# EAGLE design shield (EAGLE 5.11)
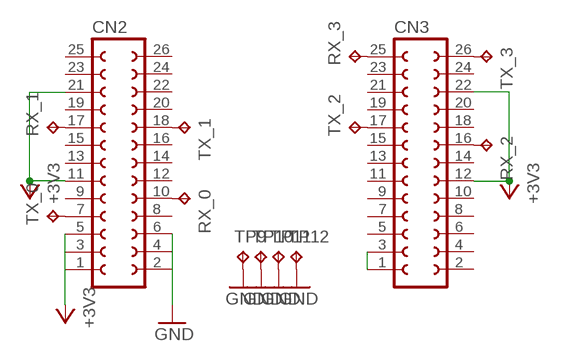
[diagram p0: schematic, sheet 1]

## Parts
CN2  FE13-2  [FE13-2]
CN3  FE13-2  [FE13-2]
RX_0  TPB1,27  [B1,27]
RX_1  TPB1,27  [B1,27]
RX_2  TPB1,27  [B1,27]
RX_3  TPB1,27  [B1,27]
TP9  TPB1,27  [B1,27]
TP10  TPB1,27  [B1,27]
TP11  TPB1,27  [B1,27]
TP12  TPB1,27  [B1,27]
TX_0  TPB1,27  [B1,27]
TX_1  TPB1,27  [B1,27]
TX_2  TPB1,27  [B1,27]
TX_3  TPB1,27  [B1,27]

## Nets
+3V3: CN2.1 CN2.3 CN2.5 CN2.11 CN2.21 CN3.12 CN3.22
GND: CN2.2 CN2.4 CN2.6 TP9.TP TP10.TP TP11.TP TP12.TP
N$1: CN3.1 CN3.3
N$4: CN2.7 TX_0.TP
N$5: CN2.10 RX_0.TP
N$6: CN2.18 TX_1.TP
N$7: CN2.17 RX_1.TP
N$8: CN3.17 TX_2.TP
N$9: CN3.16 RX_2.TP
N$10: CN3.25 RX_3.TP
N$11: CN3.26 TX_3.TP
Unconnected: CN2.8 CN2.9 CN2.12 CN2.13 CN2.14 CN2.15 CN2.16 CN2.19 CN2.20 CN2.22 CN2.23 CN2.24 CN2.25 CN2.26 CN3.2 CN3.4 CN3.5 CN3.6 CN3.7 CN3.8 CN3.9 CN3.10 CN3.11 CN3.13 CN3.14 CN3.15 CN3.18 CN3.19 CN3.20 CN3.21 CN3.23 CN3.24

## Library data of the parts
CN2 CN3 = con-lsta:FE13-2: FEMALE HEADER; OC_FARNELL: unknown; OC_NEWARK: unknown
RX_0 RX_1-RX_3 TP9-TP12 TX_0 TX_1-TX_3 = testpad:TP: Test pad

## Board
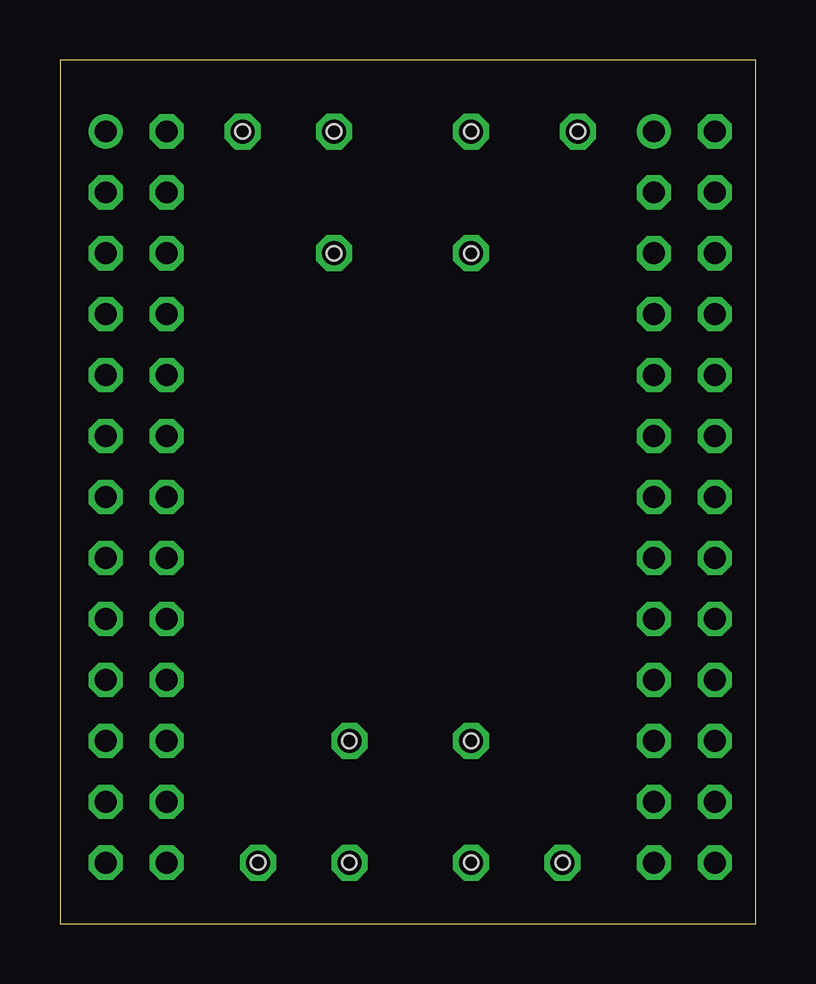
[diagram p1: board, top side]
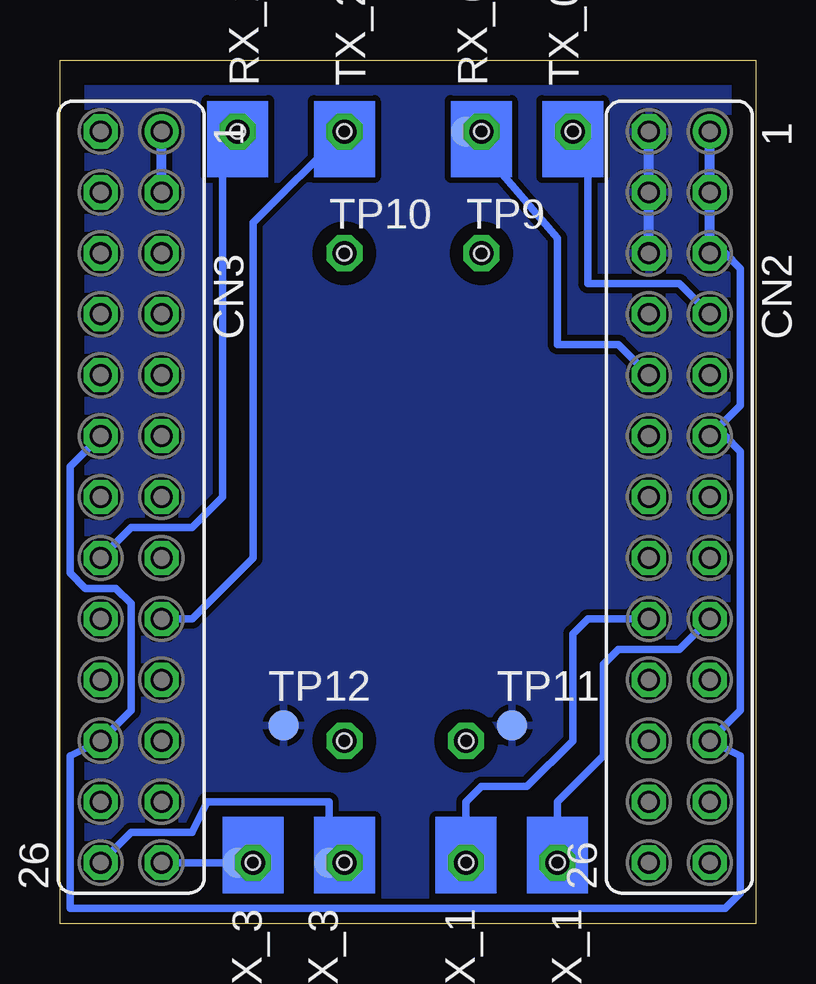
[diagram p2: board, bottom side, seen from below]

Size 29 x 36 mm. Coordinates in mm from the lower left corner, seen from the top.
Outline: 0,0 29,0 29,36 0,36 0,0
Copper layers (1*16): Top 0.035mm / dielectric 1.5mm / Bottom 0.035mm
Design rules "default *": minimum track width 10mil, minimum drill 24mil, track to track 10mil, track to pad 10mil, pad to pad 8mil, via to via 8mil, smd to smd 8mil, copper to edge 40mil, drill to drill 8mil, minimum pad ring 10mil, minimum via ring 8mil, stop-mask expansion 4mil, vias tented up to drill 0mil, thermal gap 10mil
Holes 0.6 mm at 17.14,33.02 21.59,33.02 11.43,33.02 7.62,33.02 11.43,27.94 17.14,27.94 8.26,2.54 12.06,2.54 12.06,7.62 17.14,7.62 17.14,2.54 20.95,2.54

### Footprints (pad centres in the part's own frame; a part is rotated, then mirrored left to right if it is on the bottom)
FE13-2 = drill 0.914 round: 1 -15.24,1.27 | drill 0.914 octagon: 2 -15.24,-1.27; 3 -12.7,1.27; 4 -12.7,-1.27; 5 -10.16,1.27; 6 -10.16,-1.27; 7 -7.62,1.27; 8 -7.62,-1.27; 9 -5.08,1.27; 10 -5.08,-1.27; 11 -2.54,1.27; 12 -2.54,-1.27; 13 0,1.27; 14 0,-1.27; 15 2.54,1.27; 16 2.54,-1.27; 17 5.08,1.27; 18 5.08,-1.27; 19 7.62,1.27; 20 7.62,-1.27; 21 10.16,1.27; 22 10.16,-1.27; 23 12.7,1.27; 24 12.7,-1.27; 25 15.24,1.27; 26 15.24,-1.27
B1,27 = smd 1.27 x 1.27: TP 0,0

### Placement (x,y rotation side)
CN2  3.17,17.78 270 bottom
CN3  26.04,17.78 270 bottom
RX_0  12.06,33.02 0 bottom
RX_1  8.26,2.54 0 bottom
RX_2  21.59,33.02 0 bottom
RX_3  21.59,2.54 0 bottom
TP9  11.43,27.94 0 bottom
TP10  17.14,27.94 0 bottom
TP11  10.16,8.26 0 bottom
TP12  19.68,8.26 0 bottom
TX_0  7.62,33.02 90 bottom
TX_1  12.06,2.54 0 bottom
TX_2  17.14,33.02 0 bottom
TX_3  17.78,2.54 0 bottom

### Tracks (layer width: path | path; a pad name or v marks a point on that pad's centre or on a via)
+3V3
  Bottom 0.305: CN3.12 28.57,19.05 28.57,14.61 27.94,13.97 26.67,13.97 26.04,13.34 26.04,8.89 CN3.22 28.57,6.99 28.57,0.64 1.27,0.64 0.64,1.27 0.64,6.99 CN2.21 0.64,8.89 0.64,19.68 1.27,20.32 CN2.11 0.64,21.59 0.64,27.3 1.27,27.94 CN2.5
  Bottom 0.406: CN2.1 CN2.3 CN2.5
GND  (via drill 1)
  Bottom 0.406: CN2.2 CN2.4 CN2.6
  other vias: 11.43,27.94 17.14,27.94
  pour Bottom: -1.27,37.47 30.48,37.47 30.48,-1.91 -1.27,-1.91
N$1
  Bottom 0.406: CN3.3 CN3.1
N$2  (via drill 1)
  other vias: 11.43,33.02
N$3  (via drill 1)
  other vias: 17.14,2.54
N$4  (via drill 1)
  Bottom 0.305: CN2.7 3.17,26.67 6.99,26.67 6.99,32.38 TX_0.TP
  other vias: 7.62,33.02
N$5
  Bottom 0.305: CN2.10 5.71,24.13 8.26,24.13 8.26,28.57 RX_0.TP
N$6  (via drill 1)
  Bottom 0.305: CN2.18 6.99,12.7 7.62,12.06 7.62,7.62 9.53,5.71 11.43,5.71 12.06,5.08 TX_1.TP
  other vias: 12.06,2.54
N$7  (via drill 1)
  Bottom 0.305: CN2.17 3.17,11.43 5.71,11.43 6.35,10.79 6.35,6.99 8.26,5.08 RX_1.TP
  other vias: 8.26,2.54
N$8  (via drill 1)
  Bottom 0.305: CN3.17 23.5,12.7 20.95,15.24 20.95,29.21 TX_2.TP
  other vias: 17.14,33.02
N$9  (via drill 1)
  Bottom 0.305: CN3.16 26.04,16.51 23.5,16.51 22.23,17.78 22.23,32.38 RX_2.TP
  other vias: 21.59,33.02
N$10
  Bottom 0.305: RX_3.TP CN3.25
N$11
  Bottom 0.305: CN3.26 26.04,3.81 23.5,3.81 22.86,5.08 17.78,5.08 TX_3.TP
N$12  (via drill 1)
  other vias: 20.95,2.54
N$13  (via drill 1)
  other vias: 12.06,7.62
N$14  (via drill 1)
  other vias: 17.14,7.62
(copper drawn outside any net)
  shapes: Bottom area x8